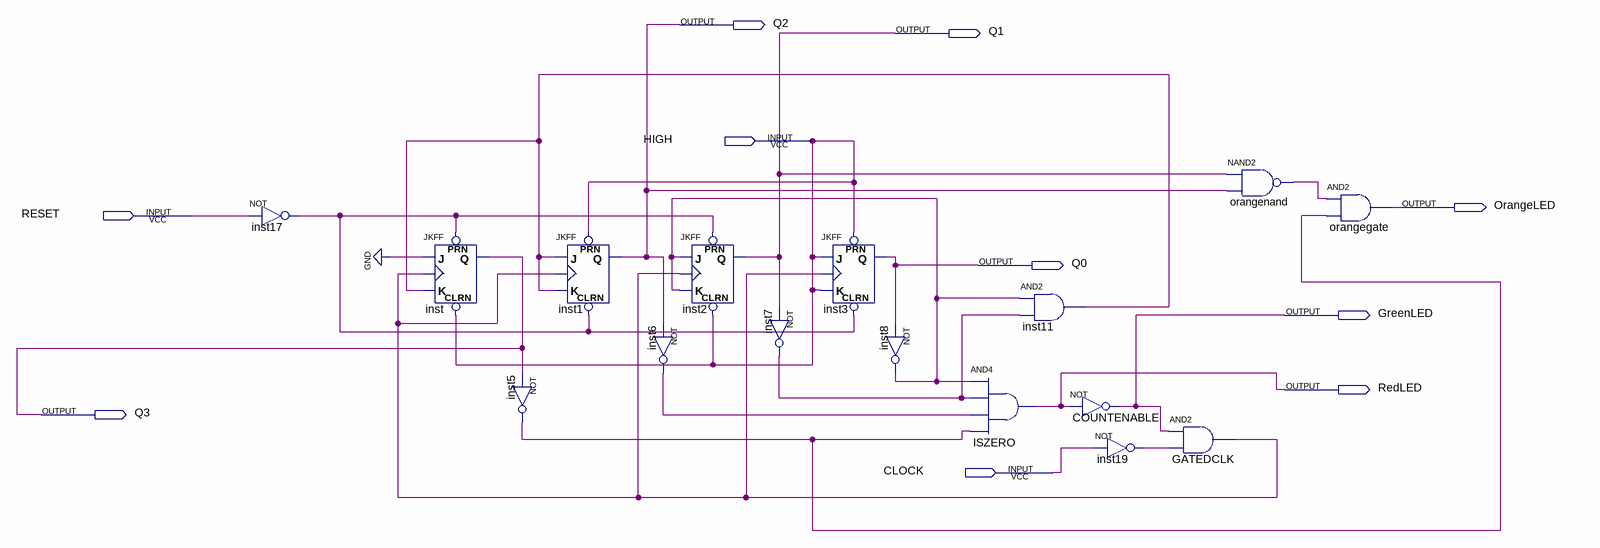
[diagram p0: schematic sheet]
// Quartus schematic FINALLOGIC.bdf as structural Verilog: 16 symbols, 10 pins
module FINALLOGIC (
  input  HIGH,
  input  RESET,
  input  CLOCK,
  output Q2,
  output Q1,
  output OrangeLED,
  output Q0,
  output GreenLED,
  output RedLED,
  output Q3
);

  wire GATEDCLK_out, inst5_out, inst6_out, inst7_out, inst8_out, inst11_out, inst17_out, inst19_out,
       orangenand_out;

  not inst17 (inst17_out, RESET);
  JKFF inst (.PRN(inst17_out), .CLRN(HIGH), .K(inst11_out), .J(1'b0), .CLK(GATEDCLK_out), .Q(Q3));
  not inst5 (inst5_out, Q3);
  JKFF inst1 (.PRN(HIGH), .CLRN(inst17_out), .K(inst11_out), .J(inst11_out), .CLK(GATEDCLK_out), .Q(Q2));
  not inst6 (inst6_out, Q2);
  JKFF inst2 (.PRN(inst17_out), .CLRN(HIGH), .K(inst8_out), .J(inst8_out), .CLK(GATEDCLK_out), .Q(Q1));
  not inst7 (inst7_out, Q1);
  JKFF inst3 (.PRN(HIGH), .CLRN(inst17_out), .K(HIGH), .J(HIGH), .CLK(GATEDCLK_out), .Q(Q0));
  not inst8 (inst8_out, Q0);
  and ISZERO (RedLED, inst8_out, inst7_out, inst6_out, inst5_out);
  and inst11 (inst11_out, inst8_out, inst7_out);
  not COUNTENABLE (GreenLED, RedLED);
  not inst19 (inst19_out, CLOCK);
  and GATEDCLK (GATEDCLK_out, GreenLED, inst19_out);
  nand orangenand (orangenand_out, Q1, Q2);
  and orangegate (OrangeLED, orangenand_out, inst5_out);
endmodule
